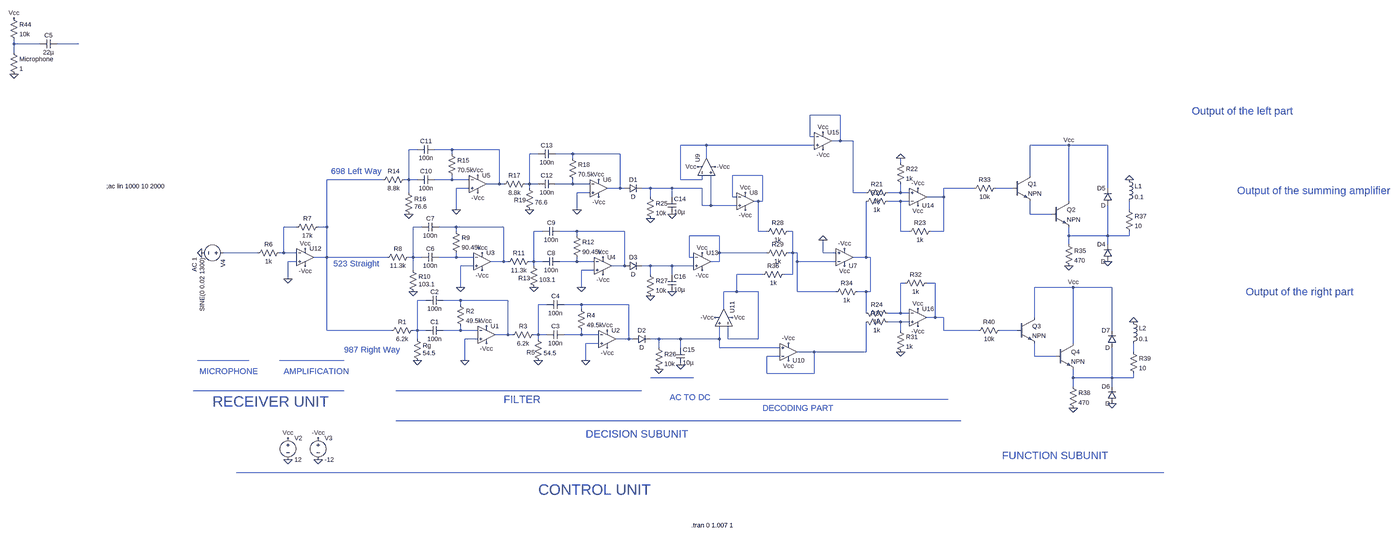
[diagram p0: schematic The_final_circuit.asc, whole sheet]
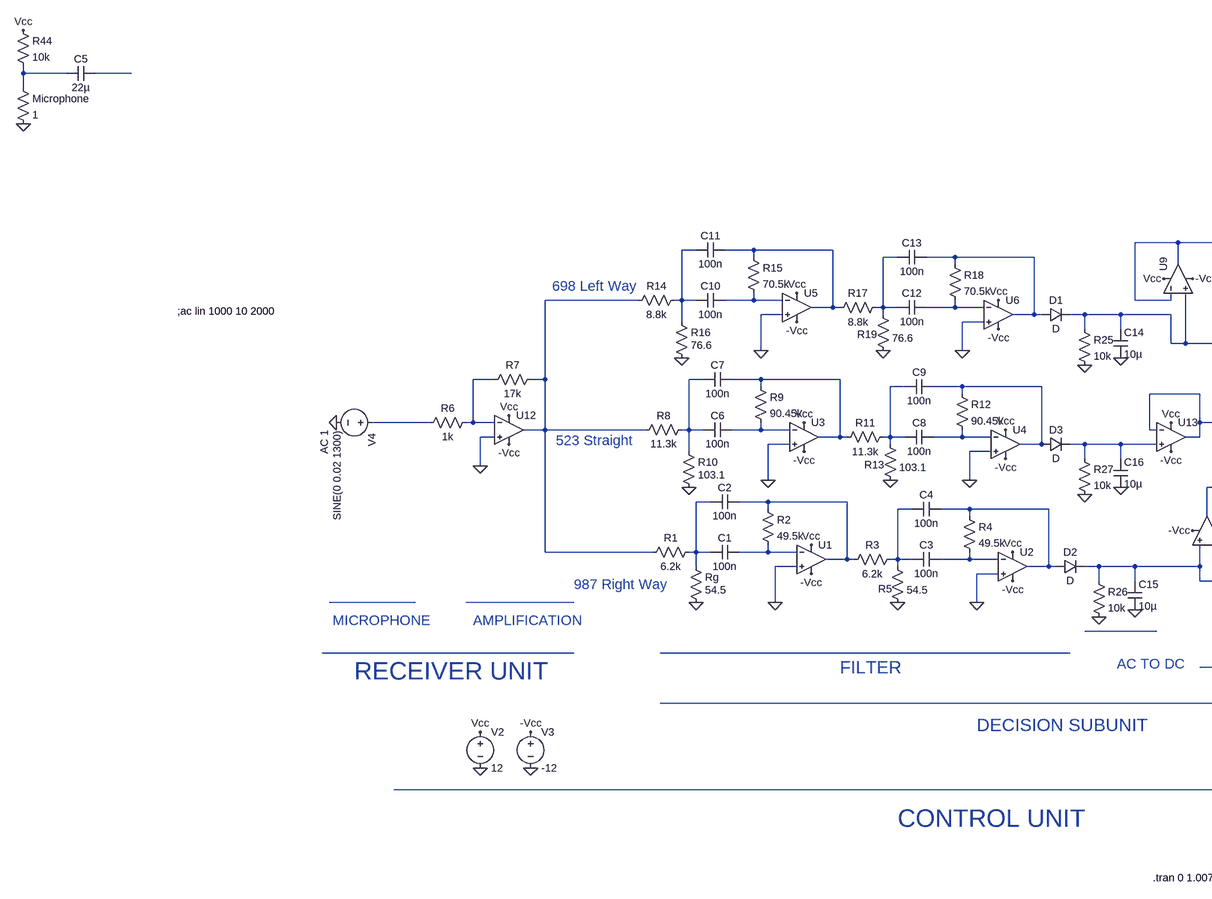
[diagram p1: schematic The_final_circuit.asc, part, row 1 of 1, column 1 of 2]
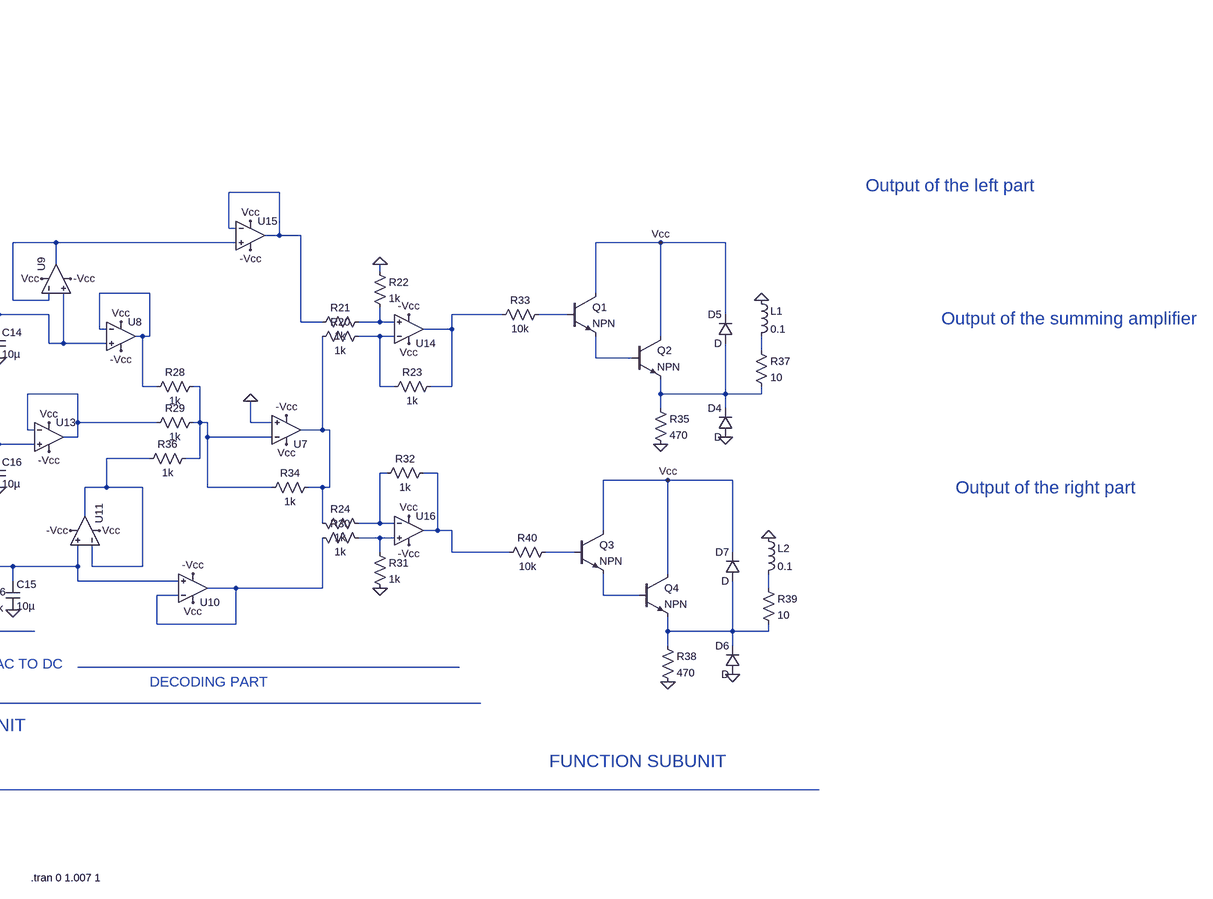
[diagram p2: schematic The_final_circuit.asc, part, row 1 of 1, column 2 of 2]
The_final_circuit.asc, the LTspice schematic file:
Version 4
SHEET 1 4472 1424
WIRE -5872 -3680 -5872 -3696
WIRE -5776 -3680 -5872 -3680
WIRE -5632 -3680 -5712 -3680
WIRE -5872 -3648 -5872 -3680
WIRE 192 -2192 80 -2192
WIRE 80 -2112 80 -2192
WIRE 96 -2112 80 -2112
WIRE 192 -2096 192 -2192
WIRE 192 -2096 160 -2096
WIRE 240 -2096 192 -2096
WIRE -304 -2080 -400 -2080
WIRE 96 -2080 -304 -2080
WIRE 1040 -2080 896 -2080
WIRE 1184 -2080 1040 -2080
WIRE -1376 -2064 -1408 -2064
WIRE -1248 -2064 -1312 -2064
WIRE -1072 -2064 -1248 -2064
WIRE -1248 -2048 -1248 -2064
WIRE -928 -2048 -960 -2048
WIRE -800 -2048 -864 -2048
WIRE -624 -2048 -800 -2048
WIRE -800 -2032 -800 -2048
WIRE -304 -2032 -304 -2080
WIRE 416 -2016 416 -2032
WIRE -96 -1968 -208 -1968
WIRE 896 -1968 896 -2080
WIRE -1504 -1952 -1712 -1952
WIRE -1408 -1952 -1408 -2064
WIRE -1408 -1952 -1424 -1952
WIRE -1376 -1952 -1408 -1952
WIRE -1248 -1952 -1248 -1968
WIRE -1248 -1952 -1312 -1952
WIRE -1184 -1952 -1248 -1952
WIRE -400 -1952 -400 -2080
WIRE -320 -1952 -320 -1968
WIRE -320 -1952 -400 -1952
WIRE -1072 -1936 -1072 -2064
WIRE -1072 -1936 -1120 -1936
WIRE -1056 -1936 -1072 -1936
WIRE -960 -1936 -960 -2048
WIRE -960 -1936 -976 -1936
WIRE -928 -1936 -960 -1936
WIRE -800 -1936 -800 -1952
WIRE -800 -1936 -864 -1936
WIRE -736 -1936 -800 -1936
WIRE -1184 -1920 -1232 -1920
WIRE -960 -1920 -960 -1936
WIRE -624 -1920 -624 -2048
WIRE -624 -1920 -672 -1920
WIRE -608 -1920 -624 -1920
WIRE -512 -1920 -544 -1920
WIRE -432 -1920 -512 -1920
WIRE -320 -1920 -432 -1920
WIRE 688 -1920 576 -1920
WIRE 832 -1920 768 -1920
WIRE 1184 -1920 1184 -2080
WIRE -1408 -1904 -1408 -1952
WIRE -736 -1904 -784 -1904
WIRE 240 -1904 240 -2096
WIRE 288 -1904 240 -1904
WIRE 416 -1904 416 -1936
WIRE 416 -1904 368 -1904
WIRE 448 -1904 416 -1904
WIRE -512 -1888 -512 -1920
WIRE -432 -1888 -432 -1920
WIRE -208 -1888 -208 -1968
WIRE -192 -1888 -208 -1888
WIRE 576 -1888 576 -1920
WIRE 576 -1888 512 -1888
WIRE -112 -1872 -128 -1872
WIRE -96 -1872 -96 -1968
WIRE -96 -1872 -112 -1872
WIRE 416 -1872 368 -1872
WIRE 448 -1872 416 -1872
WIRE 1040 -1872 1040 -2080
WIRE -320 -1856 -320 -1920
WIRE -288 -1856 -288 -1968
WIRE -288 -1856 -320 -1856
WIRE -192 -1856 -288 -1856
WIRE -1232 -1840 -1232 -1920
WIRE -784 -1840 -784 -1904
WIRE 1264 -1840 1264 -1872
WIRE 896 -1824 896 -1872
WIRE 976 -1824 896 -1824
WIRE -1824 -1776 -1872 -1776
WIRE -1712 -1776 -1712 -1952
WIRE -1712 -1776 -1744 -1776
WIRE -1360 -1776 -1392 -1776
WIRE -1232 -1776 -1296 -1776
WIRE -1056 -1776 -1232 -1776
WIRE -1232 -1760 -1232 -1776
WIRE -912 -1760 -944 -1760
WIRE -784 -1760 -848 -1760
WIRE -608 -1760 -784 -1760
WIRE -112 -1760 -112 -1872
WIRE -80 -1760 -112 -1760
WIRE 16 -1760 0 -1760
WIRE 416 -1760 416 -1872
WIRE 448 -1760 416 -1760
WIRE 576 -1760 576 -1888
WIRE 576 -1760 528 -1760
WIRE -784 -1744 -784 -1760
WIRE -256 -1744 -368 -1744
WIRE 1040 -1744 1040 -1776
WIRE 1184 -1744 1184 -1856
WIRE 1184 -1744 1040 -1744
WIRE 1264 -1744 1264 -1760
WIRE 1264 -1744 1184 -1744
WIRE 1040 -1712 1040 -1744
WIRE 1184 -1712 1184 -1744
WIRE -1968 -1680 -2096 -1680
WIRE -1872 -1680 -1872 -1776
WIRE -1872 -1680 -1888 -1680
WIRE -1824 -1680 -1872 -1680
WIRE -256 -1680 -256 -1744
WIRE -80 -1680 -256 -1680
WIRE 16 -1680 16 -1760
WIRE 16 -1680 0 -1680
WIRE 32 -1680 16 -1680
WIRE 128 -1680 128 -1728
WIRE 176 -1680 128 -1680
WIRE -1712 -1664 -1712 -1776
WIRE -1712 -1664 -1760 -1664
WIRE -1488 -1664 -1712 -1664
WIRE -1392 -1664 -1392 -1776
WIRE -1392 -1664 -1408 -1664
WIRE -1360 -1664 -1392 -1664
WIRE -1232 -1664 -1232 -1680
WIRE -1232 -1664 -1296 -1664
WIRE -1168 -1664 -1232 -1664
WIRE -368 -1664 -368 -1744
WIRE -352 -1664 -368 -1664
WIRE 288 -1664 288 -1872
WIRE 288 -1664 240 -1664
WIRE 304 -1664 288 -1664
WIRE -1824 -1648 -1856 -1648
WIRE -1056 -1648 -1056 -1776
WIRE -1056 -1648 -1104 -1648
WIRE -1040 -1648 -1056 -1648
WIRE -944 -1648 -944 -1760
WIRE -944 -1648 -960 -1648
WIRE -912 -1648 -944 -1648
WIRE -784 -1648 -784 -1664
WIRE -784 -1648 -848 -1648
WIRE -720 -1648 -784 -1648
WIRE -256 -1648 -256 -1680
WIRE -256 -1648 -288 -1648
WIRE 32 -1648 32 -1680
WIRE 176 -1648 32 -1648
WIRE -1168 -1632 -1216 -1632
WIRE -944 -1632 -944 -1648
WIRE -608 -1632 -608 -1760
WIRE -608 -1632 -656 -1632
WIRE -592 -1632 -608 -1632
WIRE -512 -1632 -544 -1632
WIRE -432 -1632 -512 -1632
WIRE -352 -1632 -432 -1632
WIRE -1392 -1616 -1392 -1664
WIRE -720 -1616 -768 -1616
WIRE -512 -1600 -512 -1632
WIRE -432 -1600 -432 -1632
WIRE -96 -1600 -192 -1600
WIRE 16 -1600 16 -1680
WIRE 16 -1600 -16 -1600
WIRE -1856 -1584 -1856 -1648
WIRE 432 -1568 416 -1568
WIRE 544 -1568 512 -1568
WIRE -1216 -1552 -1216 -1632
WIRE -768 -1552 -768 -1616
WIRE 1056 -1552 912 -1552
WIRE 1200 -1552 1056 -1552
WIRE -192 -1536 -192 -1600
WIRE -192 -1536 -240 -1536
WIRE -112 -1536 -192 -1536
WIRE 32 -1536 32 -1648
WIRE 176 -1536 32 -1536
WIRE 288 -1536 256 -1536
WIRE 304 -1536 304 -1664
WIRE 304 -1536 288 -1536
WIRE -1344 -1504 -1376 -1504
WIRE -1216 -1504 -1280 -1504
WIRE -1040 -1504 -1216 -1504
WIRE -1216 -1488 -1216 -1504
WIRE -896 -1488 -928 -1488
WIRE -768 -1488 -832 -1488
WIRE -592 -1488 -768 -1488
WIRE -768 -1472 -768 -1488
WIRE -240 -1472 -240 -1536
WIRE 288 -1456 288 -1536
WIRE 416 -1456 416 -1568
WIRE 416 -1456 368 -1456
WIRE 448 -1456 416 -1456
WIRE 544 -1440 544 -1568
WIRE 544 -1440 512 -1440
WIRE 576 -1440 544 -1440
WIRE 912 -1440 912 -1552
WIRE 416 -1424 368 -1424
WIRE 448 -1424 416 -1424
WIRE -1712 -1392 -1712 -1664
WIRE -1472 -1392 -1712 -1392
WIRE -1376 -1392 -1376 -1504
WIRE -1376 -1392 -1392 -1392
WIRE -1344 -1392 -1376 -1392
WIRE -1216 -1392 -1216 -1408
WIRE -1216 -1392 -1280 -1392
WIRE -1152 -1392 -1216 -1392
WIRE 416 -1392 416 -1424
WIRE 576 -1392 576 -1440
WIRE 704 -1392 576 -1392
WIRE 848 -1392 784 -1392
WIRE 1200 -1392 1200 -1552
WIRE -1040 -1376 -1040 -1504
WIRE -1040 -1376 -1088 -1376
WIRE -1024 -1376 -1040 -1376
WIRE -928 -1376 -928 -1488
WIRE -928 -1376 -944 -1376
WIRE -896 -1376 -928 -1376
WIRE -768 -1376 -768 -1392
WIRE -768 -1376 -832 -1376
WIRE -704 -1376 -768 -1376
WIRE -1376 -1360 -1376 -1392
WIRE -1152 -1360 -1200 -1360
WIRE -928 -1360 -928 -1376
WIRE -592 -1360 -592 -1488
WIRE -592 -1360 -640 -1360
WIRE -576 -1360 -592 -1360
WIRE -480 -1360 -512 -1360
WIRE -400 -1360 -480 -1360
WIRE -256 -1360 -256 -1408
WIRE -256 -1360 -400 -1360
WIRE -224 -1360 -224 -1408
WIRE -112 -1360 -112 -1536
WIRE -112 -1360 -224 -1360
WIRE -704 -1344 -752 -1344
WIRE 1056 -1344 1056 -1552
WIRE -480 -1328 -480 -1360
WIRE -400 -1328 -400 -1360
WIRE -256 -1328 -256 -1360
WIRE -32 -1328 -256 -1328
WIRE 96 -1312 32 -1312
WIRE 288 -1312 288 -1424
WIRE 288 -1312 96 -1312
WIRE 1280 -1312 1280 -1344
WIRE -32 -1296 -80 -1296
WIRE 912 -1296 912 -1344
WIRE 992 -1296 912 -1296
WIRE -2000 -1280 -2192 -1280
WIRE -1648 -1280 -1888 -1280
WIRE -1200 -1280 -1200 -1360
WIRE -752 -1280 -752 -1344
WIRE -80 -1232 -80 -1296
WIRE 96 -1232 96 -1312
WIRE 96 -1232 -80 -1232
WIRE -352 -1216 -512 -1216
WIRE 1056 -1216 1056 -1248
WIRE 1200 -1216 1200 -1328
WIRE 1200 -1216 1056 -1216
WIRE 1280 -1216 1280 -1232
WIRE 1280 -1216 1200 -1216
WIRE 1056 -1184 1056 -1216
WIRE 1200 -1184 1200 -1216
WIRE -1648 -1168 -2208 -1168
WIRE -544 -1168 -1456 -1168
WIRE 592 -1136 -256 -1136
WIRE 640 -1056 -1456 -1056
WIRE 1392 -864 -2048 -864
FLAG -1376 -1280 0
FLAG -2176 -1680 0
FLAG -1120 -1344 -Vcc
FLAG -1200 -1280 0
FLAG -928 -1280 0
FLAG -672 -1392 Vcc
FLAG -672 -1328 -Vcc
FLAG -752 -1280 0
FLAG -1392 -1536 0
FLAG -1136 -1680 Vcc
FLAG -1136 -1616 -Vcc
FLAG -1216 -1552 0
FLAG -944 -1552 0
FLAG -688 -1664 Vcc
FLAG -688 -1600 -Vcc
FLAG -768 -1552 0
FLAG -1408 -1824 0
FLAG -1152 -1968 Vcc
FLAG -1152 -1904 -Vcc
FLAG -1232 -1840 0
FLAG -960 -1840 0
FLAG -704 -1952 Vcc
FLAG -704 -1888 -Vcc
FLAG -784 -1840 0
FLAG -512 -1520 0
FLAG -432 -1536 0
FLAG -400 -1264 0
FLAG -480 -1248 0
FLAG -512 -1808 0
FLAG -432 -1824 0
FLAG -1856 -1584 0
FLAG -1792 -1632 -Vcc
FLAG -1120 -1408 Vcc
FLAG -1792 -1696 Vcc
FLAG -1856 -992 Vcc
FLAG -1744 -992 -Vcc
FLAG -1856 -912 0
FLAG -1744 -912 0
FLAG 208 -1632 Vcc
FLAG 208 -1696 -Vcc
FLAG -336 -2000 Vcc
FLAG -272 -2000 -Vcc
FLAG 0 -1280 Vcc
FLAG 0 -1344 -Vcc
FLAG -160 -1904 Vcc
FLAG -160 -1840 -Vcc
FLAG -208 -1440 Vcc
FLAG -272 -1440 -Vcc
FLAG -320 -1680 Vcc
FLAG -320 -1616 -Vcc
FLAG 480 -1856 Vcc
FLAG 480 -1920 -Vcc
FLAG 1040 -1632 0
FLAG 1184 -1648 0
FLAG 1040 -2080 Vcc
FLAG 1264 -1952 0
FLAG 1056 -1104 0
FLAG 1200 -1120 0
FLAG 1056 -1552 Vcc
FLAG 1280 -1424 0
FLAG 128 -2128 Vcc
FLAG 128 -2064 -Vcc
FLAG -5872 -3776 Vcc
FLAG -5872 -3568 0
FLAG 128 -1728 0
FLAG 416 -2032 0
FLAG 480 -1472 Vcc
FLAG 480 -1408 -Vcc
FLAG 416 -1312 0
SYMBOL res -1376 -1408 R90
WINDOW 0 0 56 VBottom 2
WINDOW 3 32 56 VTop 2
SYMATTR InstName R1
SYMATTR Value 6.2k
SYMBOL cap -1280 -1408 R90
WINDOW 0 0 32 VBottom 2
WINDOW 3 32 32 VTop 2
SYMATTR InstName C1
SYMATTR Value 100n
SYMBOL cap -1280 -1520 R90
WINDOW 0 0 32 VBottom 2
WINDOW 3 32 32 VTop 2
SYMATTR InstName C2
SYMATTR Value 100n
SYMBOL res -1232 -1504 R0
SYMATTR InstName R2
SYMATTR Value 49.5k
SYMBOL Opamps\\UniversalOpamp2 -1120 -1376 R0
SYMATTR InstName U1
SYMBOL res -1392 -1376 R0
WINDOW 3 36 68 Left 2
SYMATTR Value 54.5
SYMATTR InstName Rg
SYMBOL res -928 -1392 R90
WINDOW 0 0 56 VBottom 2
WINDOW 3 33 56 VTop 2
SYMATTR InstName R3
SYMATTR Value 6.2k
SYMBOL cap -832 -1392 R90
WINDOW 0 0 32 VBottom 2
WINDOW 3 32 32 VTop 2
SYMATTR InstName C3
SYMATTR Value 100n
SYMBOL cap -832 -1504 R90
WINDOW 0 0 32 VBottom 2
WINDOW 3 32 32 VTop 2
SYMATTR InstName C4
SYMATTR Value 100n
SYMBOL res -784 -1488 R0
SYMATTR InstName R4
SYMATTR Value 49.5k
SYMBOL Opamps\\UniversalOpamp2 -672 -1360 R0
SYMATTR InstName U2
SYMBOL res -944 -1376 R0
WINDOW 3 36 68 Left 2
WINDOW 0 -27 66 Left 2
SYMATTR Value 54.5
SYMATTR InstName R5
SYMBOL voltage -2080 -1680 R90
WINDOW 3 17 94 Left 2
WINDOW 123 17 122 Left 2
WINDOW 39 0 0 Left 2
SYMATTR Value SINE(0 0.02 1300)
SYMATTR Value2 AC 1
SYMATTR InstName V4
SYMBOL res -1392 -1680 R90
WINDOW 0 0 56 VBottom 2
WINDOW 3 32 56 VTop 2
SYMATTR InstName R8
SYMATTR Value 11.3k
SYMBOL cap -1296 -1680 R90
WINDOW 0 0 32 VBottom 2
WINDOW 3 32 32 VTop 2
SYMATTR InstName C6
SYMATTR Value 100n
SYMBOL cap -1296 -1792 R90
WINDOW 0 0 32 VBottom 2
WINDOW 3 32 32 VTop 2
SYMATTR InstName C7
SYMATTR Value 100n
SYMBOL res -1248 -1776 R0
SYMATTR InstName R9
SYMATTR Value 90.45k
SYMBOL Opamps\\UniversalOpamp2 -1136 -1648 R0
SYMATTR InstName U3
SYMBOL res -1408 -1632 R0
WINDOW 3 36 68 Left 2
SYMATTR Value 103.1
SYMATTR InstName R10
SYMBOL res -944 -1664 R90
WINDOW 0 0 56 VBottom 2
WINDOW 3 33 56 VTop 2
SYMATTR InstName R11
SYMATTR Value 11.3k
SYMBOL cap -848 -1664 R90
WINDOW 0 0 32 VBottom 2
WINDOW 3 32 32 VTop 2
SYMATTR InstName C8
SYMATTR Value 100n
SYMBOL cap -848 -1776 R90
WINDOW 0 0 32 VBottom 2
WINDOW 3 32 32 VTop 2
SYMATTR InstName C9
SYMATTR Value 100n
SYMBOL res -800 -1760 R0
SYMATTR InstName R12
SYMATTR Value 90.45k
SYMBOL Opamps\\UniversalOpamp2 -688 -1632 R0
SYMATTR InstName U4
SYMBOL res -960 -1648 R0
WINDOW 3 36 68 Left 2
WINDOW 0 -42 62 Left 2
SYMATTR Value 103.1
SYMATTR InstName R13
SYMBOL res -1408 -1968 R90
WINDOW 0 0 56 VBottom 2
WINDOW 3 32 56 VTop 2
SYMATTR InstName R14
SYMATTR Value 8.8k
SYMBOL cap -1312 -1968 R90
WINDOW 0 0 32 VBottom 2
WINDOW 3 32 32 VTop 2
SYMATTR InstName C10
SYMATTR Value 100n
SYMBOL cap -1312 -2080 R90
WINDOW 0 0 32 VBottom 2
WINDOW 3 32 32 VTop 2
SYMATTR InstName C11
SYMATTR Value 100n
SYMBOL res -1264 -2064 R0
SYMATTR InstName R15
SYMATTR Value 70.5k
SYMBOL Opamps\\UniversalOpamp2 -1152 -1936 R0
SYMATTR InstName U5
SYMBOL res -1424 -1920 R0
WINDOW 3 36 68 Left 2
SYMATTR Value 76.6
SYMATTR InstName R16
SYMBOL res -960 -1952 R90
WINDOW 0 0 56 VBottom 2
WINDOW 3 33 56 VTop 2
SYMATTR InstName R17
SYMATTR Value 8.8k
SYMBOL cap -864 -1952 R90
WINDOW 0 0 32 VBottom 2
WINDOW 3 32 32 VTop 2
SYMATTR InstName C12
SYMATTR Value 100n
SYMBOL cap -864 -2064 R90
WINDOW 0 0 32 VBottom 2
WINDOW 3 32 32 VTop 2
SYMATTR InstName C13
SYMATTR Value 100n
SYMBOL res -816 -2048 R0
SYMATTR InstName R18
SYMATTR Value 70.5k
SYMBOL Opamps\\UniversalOpamp2 -704 -1920 R0
SYMATTR InstName U6
SYMBOL res -976 -1936 R0
WINDOW 3 36 68 Left 2
WINDOW 0 -42 60 Left 2
SYMATTR Value 76.6
SYMATTR InstName R19
SYMBOL diode -608 -1904 R270
WINDOW 0 32 32 VTop 2
WINDOW 3 0 32 VBottom 2
SYMATTR InstName D1
SYMBOL diode -576 -1344 R270
WINDOW 0 32 32 VTop 2
WINDOW 3 0 32 VBottom 2
SYMATTR InstName D2
SYMBOL diode -608 -1616 R270
WINDOW 0 32 32 VTop 2
WINDOW 3 0 32 VBottom 2
SYMATTR InstName D3
SYMBOL res -528 -1904 R0
SYMATTR InstName R25
SYMATTR Value 10k
SYMBOL res -496 -1344 R0
SYMATTR InstName R26
SYMATTR Value 10k
SYMBOL res -528 -1616 R0
SYMATTR InstName R27
SYMATTR Value 10k
SYMBOL cap -448 -1888 R0
SYMATTR InstName C14
SYMATTR Value 10µ
SYMBOL cap -416 -1328 R0
SYMATTR InstName C15
SYMATTR Value 10µ
SYMBOL cap -448 -1600 R0
SYMATTR InstName C16
SYMATTR Value 10µ
SYMBOL Opamps\\UniversalOpamp2 -1792 -1664 R0
SYMATTR InstName U12
SYMBOL res -1872 -1696 R90
WINDOW 0 0 56 VBottom 2
WINDOW 3 32 56 VTop 2
SYMATTR InstName R6
SYMATTR Value 1k
SYMBOL res -1728 -1792 R90
WINDOW 0 0 56 VBottom 2
WINDOW 3 32 56 VTop 2
SYMATTR InstName R7
SYMATTR Value 17k
SYMBOL voltage -1856 -1008 R0
WINDOW 123 0 0 Left 2
WINDOW 39 0 0 Left 2
SYMATTR InstName V2
SYMATTR Value 12
SYMBOL voltage -1744 -1008 R0
WINDOW 123 0 0 Left 2
WINDOW 39 0 0 Left 2
SYMATTR InstName V3
SYMATTR Value -12
SYMBOL Opamps\\UniversalOpamp2 208 -1664 M180
SYMATTR InstName U7
SYMBOL res 16 -1776 R90
WINDOW 0 0 56 VBottom 2
WINDOW 3 32 56 VTop 2
SYMATTR InstName R28
SYMATTR Value 1k
SYMBOL res 16 -1696 R90
WINDOW 0 0 56 VBottom 2
WINDOW 3 32 56 VTop 2
SYMATTR InstName R29
SYMATTR Value 1k
SYMBOL Opamps\\UniversalOpamp2 -304 -2000 R270
SYMATTR InstName U9
SYMBOL Opamps\\UniversalOpamp2 0 -1312 M180
SYMATTR InstName U10
SYMBOL res 272 -1552 R90
WINDOW 0 0 56 VBottom 2
WINDOW 3 32 56 VTop 2
SYMATTR InstName R34
SYMATTR Value 1k
SYMBOL res 0 -1616 R90
WINDOW 0 0 56 VBottom 2
WINDOW 3 32 56 VTop 2
SYMATTR InstName R36
SYMATTR Value 1k
SYMBOL Opamps\\UniversalOpamp2 -160 -1872 R0
SYMATTR InstName U8
SYMBOL Opamps\\UniversalOpamp2 -240 -1440 M270
SYMATTR InstName U11
SYMBOL Opamps\\UniversalOpamp2 -320 -1648 R0
SYMATTR InstName U13
SYMBOL npn 832 -1968 R0
SYMATTR InstName Q1
SYMBOL npn 976 -1872 R0
SYMATTR InstName Q2
SYMBOL Opamps\\UniversalOpamp2 480 -1888 M180
SYMATTR InstName U14
SYMBOL res 384 -1888 R90
WINDOW 0 0 56 VBottom 2
WINDOW 3 32 56 VTop 2
SYMATTR InstName R20
SYMATTR Value 1k
SYMBOL res 384 -1920 R90
WINDOW 0 0 56 VBottom 2
WINDOW 3 32 56 VTop 2
SYMATTR InstName R21
SYMATTR Value 1k
SYMBOL res 384 -1440 M270
WINDOW 0 32 56 VTop 2
WINDOW 3 0 56 VBottom 2
SYMATTR InstName R24
SYMATTR Value 1k
SYMBOL res 384 -1408 M270
WINDOW 0 32 56 VTop 2
WINDOW 3 0 56 VBottom 2
SYMATTR InstName R30
SYMATTR Value 1k
SYMBOL res 1024 -1728 R0
SYMATTR InstName R35
SYMATTR Value 470
SYMBOL diode 1200 -1648 R180
WINDOW 0 24 64 Left 2
WINDOW 3 24 0 Left 2
SYMATTR InstName D4
SYMBOL diode 1200 -1856 R180
WINDOW 0 24 64 Left 2
WINDOW 3 24 0 Left 2
SYMATTR InstName D5
SYMBOL res 1248 -1856 R0
SYMATTR InstName R37
SYMATTR Value 10
SYMBOL ind 1248 -1968 R0
SYMATTR InstName L1
SYMATTR Value 0.1
SYMBOL npn 848 -1440 R0
SYMATTR InstName Q3
SYMBOL npn 992 -1344 R0
SYMATTR InstName Q4
SYMBOL res 1040 -1200 R0
SYMATTR InstName R38
SYMATTR Value 470
SYMBOL diode 1216 -1120 R180
WINDOW 0 24 64 Left 2
WINDOW 3 24 0 Left 2
SYMATTR InstName D6
SYMBOL diode 1216 -1328 R180
WINDOW 0 24 64 Left 2
WINDOW 3 24 0 Left 2
SYMATTR InstName D7
SYMBOL res 1264 -1328 R0
SYMATTR InstName R39
SYMATTR Value 10
SYMBOL ind 1264 -1440 R0
SYMATTR InstName L2
SYMATTR Value 0.1
SYMBOL Opamps\\UniversalOpamp2 128 -2096 R0
SYMATTR InstName U15
SYMBOL res -5888 -3792 R0
SYMATTR InstName R44
SYMATTR Value 10k
SYMBOL res -5888 -3664 R0
SYMATTR InstName Microphone
SYMATTR Value 1
SYMBOL cap -5712 -3696 R90
WINDOW 0 0 32 VBottom 2
WINDOW 3 32 32 VTop 2
SYMATTR InstName C5
SYMATTR Value 22µ
SYMBOL res 400 -2032 R0
SYMATTR InstName R22
SYMATTR Value 1k
SYMBOL res 544 -1776 R90
WINDOW 0 0 56 VBottom 2
WINDOW 3 32 56 VTop 2
SYMATTR InstName R23
SYMATTR Value 1k
SYMBOL Opamps\\UniversalOpamp2 480 -1440 R0
SYMATTR InstName U16
SYMBOL res 400 -1408 R0
SYMATTR InstName R31
SYMATTR Value 1k
SYMBOL res 528 -1584 R90
WINDOW 0 0 56 VBottom 2
WINDOW 3 32 56 VTop 2
SYMATTR InstName R32
SYMATTR Value 1k
SYMBOL res 784 -1936 R90
WINDOW 0 0 56 VBottom 2
WINDOW 3 32 56 VTop 2
SYMATTR InstName R33
SYMATTR Value 10k
SYMBOL res 800 -1408 R90
WINDOW 0 0 56 VBottom 2
WINDOW 3 32 56 VTop 2
SYMATTR InstName R40
SYMATTR Value 10k
TEXT -1696 -1984 Left 3 ;698 Left Way
TEXT -1688 -1640 Left 3 ;523 Straight
TEXT -1648 -1320 Left 3 ;987 Right Way
TEXT -360 552 Left 2 !.tran 0 1.007 1
TEXT 2384 -2208 Left 4 ;Output of the left part
TEXT 2552 -1912 Left 4 ;Output of the summing amplifier
TEXT 2584 -1536 Left 4 ;Output of the right part
TEXT -1056 -1136 Left 4 ;FILTER
TEXT -1872 -1240 Left 3 ;AMPLIFICATION
TEXT -2184 -1240 Left 3 ;MICROPHONE
TEXT -2136 -1128 Left 5 ;RECEIVER UNIT
TEXT -440 -1144 Left 3 ;AC TO DC
TEXT -96 -1104 Left 3 ;DECODING PART
TEXT -752 -1008 Left 4 ;DECISION SUBUNIT
TEXT 792 -928 Left 4 ;FUNCTION SUBUNIT
TEXT -928 -800 Left 5 ;CONTROL UNIT
TEXT -2648 -1928 Left 2 !;ac lin 1000 10 2000

The netlist it stands for:
* The_final_circuit.asc
R1 N036 N010 6.2k
C1 N041 N036 100n
C2 N037 N036 100n
R2 N037 N041 49.5k
XU1 0 N041 Vcc -Vcc N037 level.2 Avol=1Meg GBW=10Meg Slew=10Meg ilimit=25m rail=0 Vos=0 phimargin=45 en=0 enk=0 in=0 ink=0 Rin=500Meg  ; pins IN+ IN- V+ V- OUT
Rg N036 0 54.5
R3 N038 N037 6.2k
C3 N043 N038 100n
C4 N039 N038 100n
R4 N039 N043 49.5k
XU2 0 N043 Vcc -Vcc N039 level.2 Avol=1Meg GBW=10Meg Slew=10Meg ilimit=25m rail=0 Vos=0 phimargin=45 en=0 enk=0 in=0 ink=0 Rin=500Meg  ; pins IN+ IN- V+ V- OUT
R5 N038 0 54.5
V4 N028 0 SINE(0 0.02 1300) AC 1
R8 N021 N010 11.3k
C6 N029 N021 100n
C7 N022 N021 100n
R9 N022 N029 90.45k
XU3 0 N029 Vcc -Vcc N022 level.2 Avol=1Meg GBW=10Meg Slew=10Meg ilimit=25m rail=0 Vos=0 phimargin=45 en=0 enk=0 in=0 ink=0 Rin=500Meg  ; pins IN+ IN- V+ V- OUT
R10 N021 0 103.1
R11 N023 N022 11.3k
C8 N031 N023 100n
C9 N024 N023 100n
R12 N024 N031 90.45k
XU4 0 N031 Vcc -Vcc N024 level.2 Avol=1Meg GBW=10Meg Slew=10Meg ilimit=25m rail=0 Vos=0 phimargin=45 en=0 enk=0 in=0 ink=0 Rin=500Meg  ; pins IN+ IN- V+ V- OUT
R13 N023 0 103.1
R14 N005 N010 8.8k
C10 N011 N005 100n
C11 N006 N005 100n
R15 N006 N011 70.5k
XU5 0 N011 Vcc -Vcc N006 level.2 Avol=1Meg GBW=10Meg Slew=10Meg ilimit=25m rail=0 Vos=0 phimargin=45 en=0 enk=0 in=0 ink=0 Rin=500Meg  ; pins IN+ IN- V+ V- OUT
R16 N005 0 76.6
R17 N007 N006 8.8k
C12 N012 N007 100n
C13 N008 N007 100n
R18 N008 N012 70.5k
XU6 0 N012 Vcc -Vcc N008 level.2 Avol=1Meg GBW=10Meg Slew=10Meg ilimit=25m rail=0 Vos=0 phimargin=45 en=0 enk=0 in=0 ink=0 Rin=500Meg  ; pins IN+ IN- V+ V- OUT
R19 N007 0 76.6
D1 N008 N013 D
D2 N039 N044 D
D3 N024 N032 D
R25 N013 0 10k
R26 N044 0 10k
R27 N032 0 10k
C14 N013 0 10µ
C15 N044 0 10µ
C16 N032 0 10µ
XU12 0 N020 Vcc -Vcc N010 level.2 Avol=1Meg GBW=10Meg Slew=10Meg ilimit=25m rail=0 Vos=0 phimargin=45 en=0 enk=0 in=0 ink=0 Rin=500Meg  ; pins IN+ IN- V+ V- OUT
R6 N020 N028 1k
R7 N010 N020 17k
V2 Vcc 0 12
V3 -Vcc 0 -12
XU7 0 N025 Vcc -Vcc N030 level.2 Avol=1Meg GBW=10Meg Slew=10Meg ilimit=25m rail=0 Vos=0 phimargin=45 en=0 enk=0 in=0 ink=0 Rin=500Meg  ; pins IN+ IN- V+ V- OUT
R28 N025 N009 1k
R29 N025 N026 1k
XU9 N013 N004 Vcc -Vcc N004 level.2 Avol=1Meg GBW=10Meg Slew=10Meg ilimit=25m rail=0 Vos=0 phimargin=45 en=0 enk=0 in=0 ink=0 Rin=500Meg  ; pins IN+ IN- V+ V- OUT
XU10 N044 N045 Vcc -Vcc N045 level.2 Avol=1Meg GBW=10Meg Slew=10Meg ilimit=25m rail=0 Vos=0 phimargin=45 en=0 enk=0 in=0 ink=0 Rin=500Meg  ; pins IN+ IN- V+ V- OUT
R34 N030 N025 1k
R36 N025 N033 1k
XU8 N013 N009 Vcc -Vcc N009 level.2 Avol=1Meg GBW=10Meg Slew=10Meg ilimit=25m rail=0 Vos=0 phimargin=45 en=0 enk=0 in=0 ink=0 Rin=500Meg  ; pins IN+ IN- V+ V- OUT
XU11 N044 N033 Vcc -Vcc N033 level.2 Avol=1Meg GBW=10Meg Slew=10Meg ilimit=25m rail=0 Vos=0 phimargin=45 en=0 enk=0 in=0 ink=0 Rin=500Meg  ; pins IN+ IN- V+ V- OUT
XU13 N032 N026 Vcc -Vcc N026 level.2 Avol=1Meg GBW=10Meg Slew=10Meg ilimit=25m rail=0 Vos=0 phimargin=45 en=0 enk=0 in=0 ink=0 Rin=500Meg  ; pins IN+ IN- V+ V- OUT
Q1 Vcc N015 N019 0 NPN
Q2 Vcc N019 N027 0 NPN
XU14 N016 N017 Vcc -Vcc N014 level.2 Avol=1Meg GBW=10Meg Slew=10Meg ilimit=25m rail=0 Vos=0 phimargin=45 en=0 enk=0 in=0 ink=0 Rin=500Meg  ; pins IN+ IN- V+ V- OUT
R20 N017 N030 1k
R21 N016 N003 1k
R24 N034 N030 1k
R30 N040 N045 1k
R35 N027 0 470
D4 0 N027 D
D5 N027 Vcc D
R37 N018 N027 10
L1 0 N018 0.1
Q3 Vcc N042 N047 0 NPN
Q4 Vcc N047 N051 0 NPN
R38 N051 0 470
D6 0 N051 D
D7 N051 Vcc D
R39 N046 N051 10
L2 0 N046 0.1
XU15 N004 N003 Vcc -Vcc N003 level.2 Avol=1Meg GBW=10Meg Slew=10Meg ilimit=25m rail=0 Vos=0 phimargin=45 en=0 enk=0 in=0 ink=0 Rin=500Meg  ; pins IN+ IN- V+ V- OUT
R44 Vcc N001 10k
R§Microphone N001 0 1
C5 N002 N001 22µ
R22 0 N016 1k
R23 N014 N017 1k
XU16 N040 N034 Vcc -Vcc N035 level.2 Avol=1Meg GBW=10Meg Slew=10Meg ilimit=25m rail=0 Vos=0 phimargin=45 en=0 enk=0 in=0 ink=0 Rin=500Meg  ; pins IN+ IN- V+ V- OUT
R31 N040 0 1k
R32 N035 N034 1k
R33 N015 N014 10k
R40 N042 N035 10k
.model D D
.lib standard.dio
.model NPN NPN
.model PNP PNP
.lib standard.bjt
* 698 Left Way
* 523 Straight
* 987 Right Way
.tran 0 1.007 1
* Output of the left part
* Output of the summing amplifier
* Output of the right part
* FILTER
* AMPLIFICATION
* MICROPHONE
* RECEIVER UNIT
* AC TO DC
* DECODING PART
* DECISION SUBUNIT
* FUNCTION SUBUNIT
* CONTROL UNIT
;ac lin 1000 10 2000
.lib UniversalOpamps2.sub
.backanno
.end